# Altium project project.PrjPcb
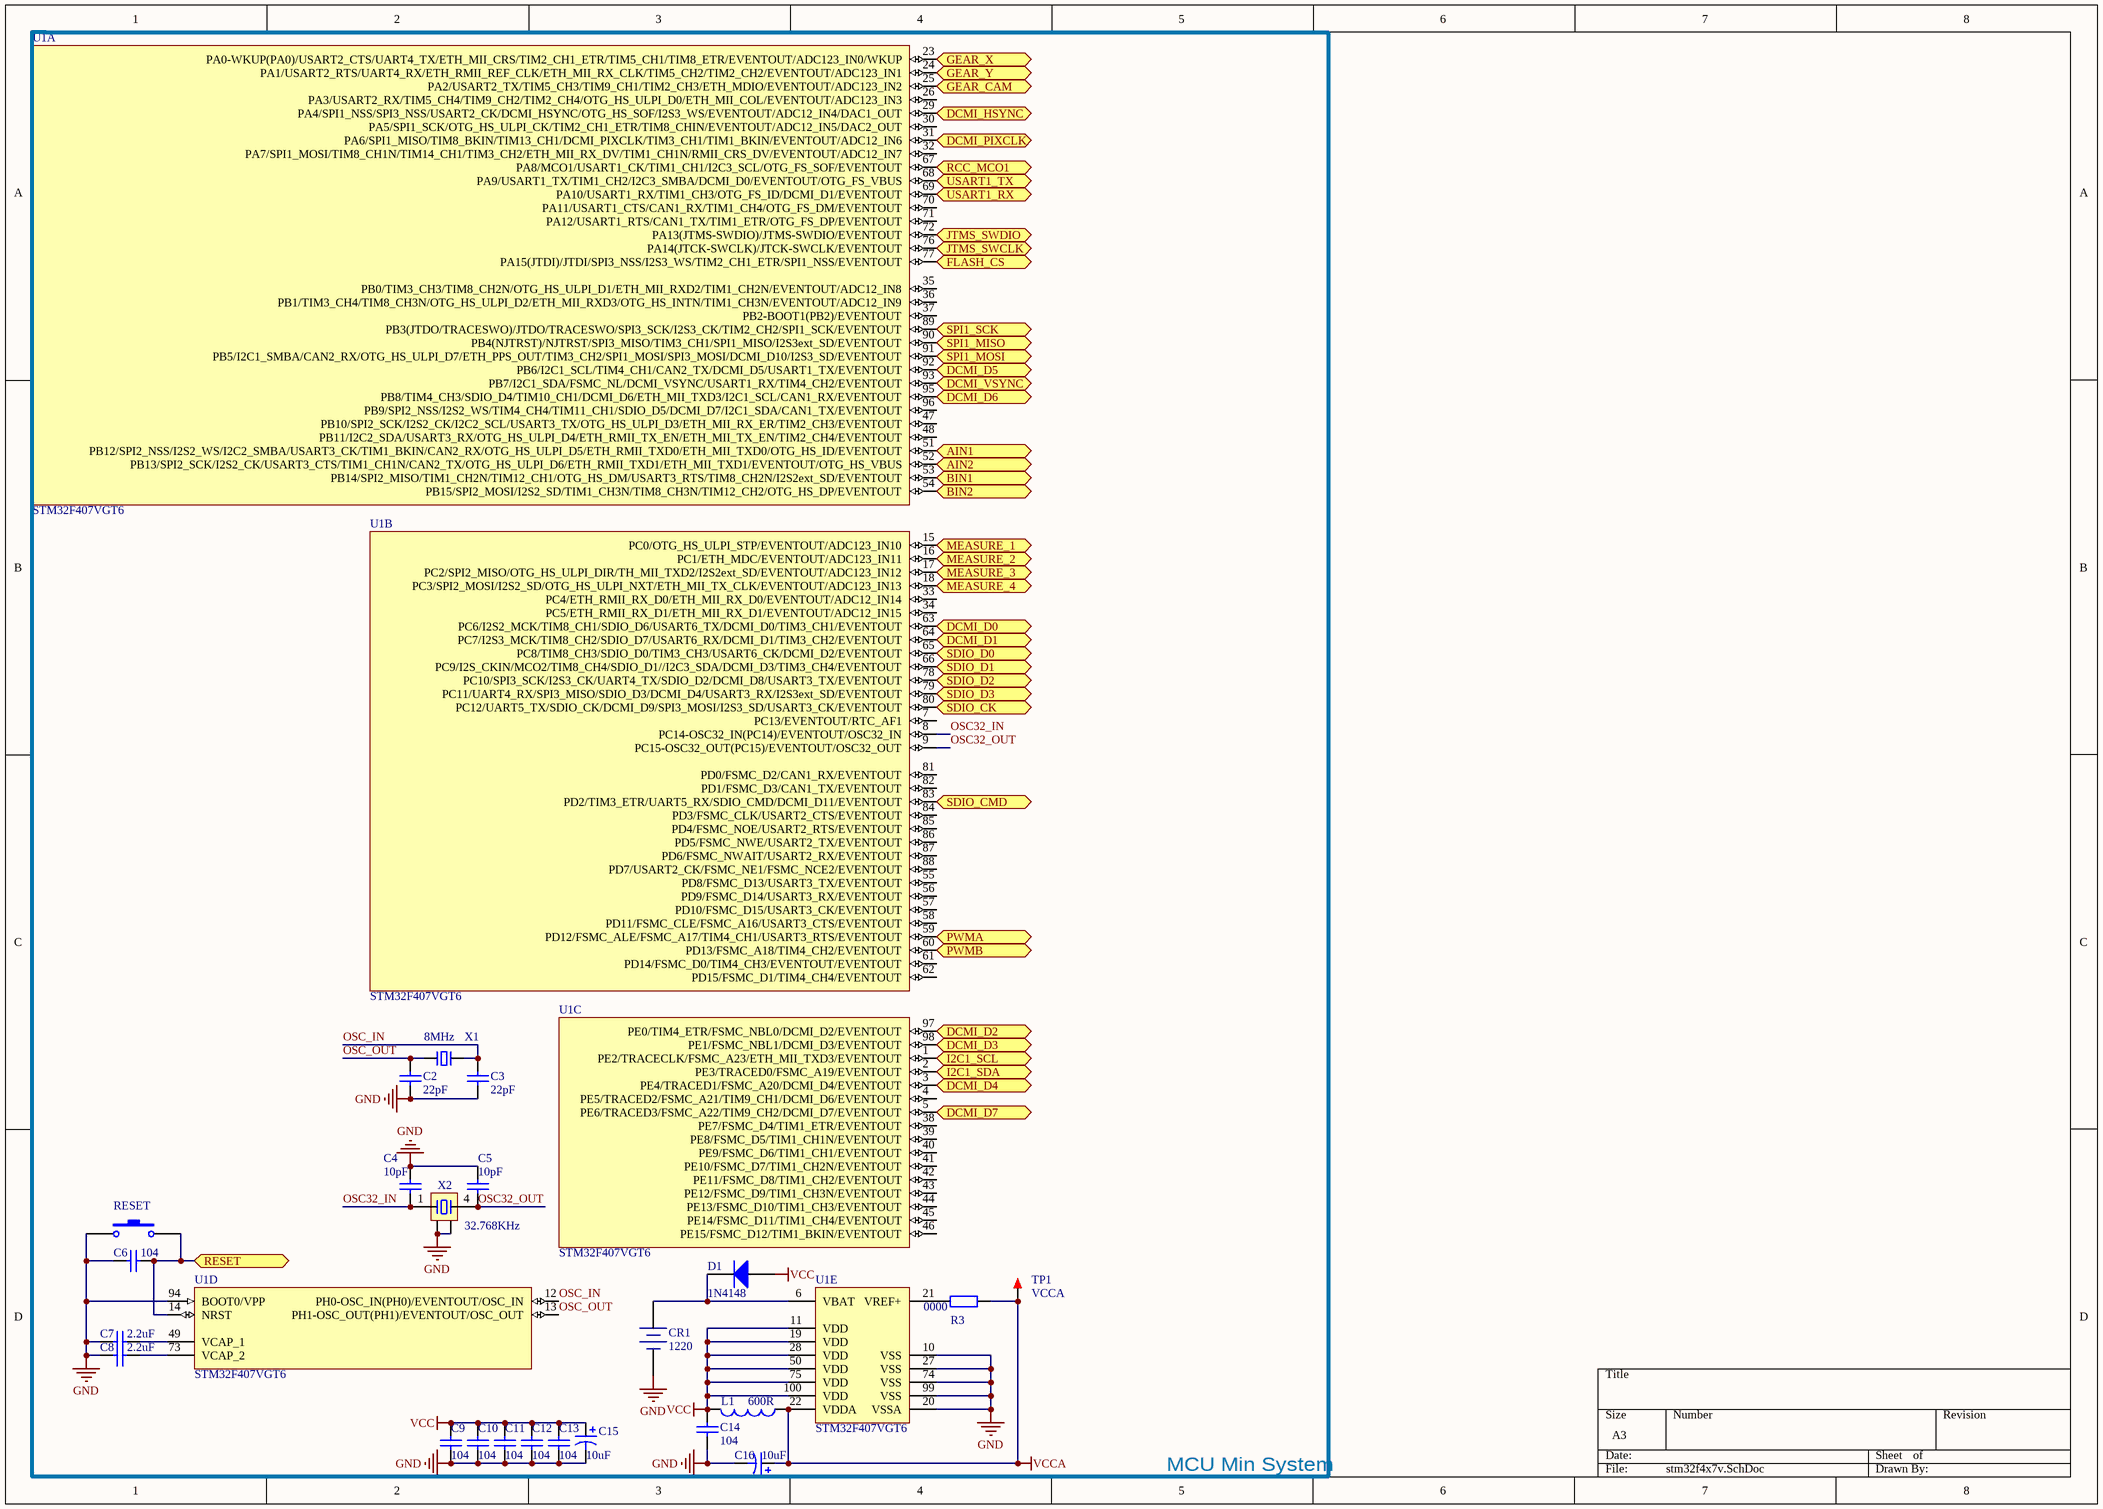
[diagram p0: stm32f4x7v.SchDoc]
4 sheets, 43 parts. Net scope: flat (ports and power ports of the same name join across sheets).
Board file: main_control_board_1.1.0.PcbDoc
Sheets:
  stm32f4x7v.SchDoc
  wifi.SchDoc
  buck.SchDoc
  steering_engine_interface.SchDoc

## Sheet stm32f4x7v.SchDoc
size A3

### Parts
C2  22pF  [C 0603_L]
C3  22pF  [C 0603_L]
C4  10pF  [C 0603_L]
C5  10pF  [C 0603_L]
C6  104  [C 0603_L]
C7  2.2uF  [C 0603_L]
C8  2.2uF  [C 0603_L]
C9  104  [C 0603_L]
C10  104  [C 0603_L]
C11  104  [C 0603_L]
C12  104  [C 0603_L]
C13  104  [C 0603_L]
C14  104  [C 0603_L]
C15  10uF  [CD A(3216)]
C16  10uF  [CD A(3216)]
CR1  1220  [ML621FE]
D1  1N4148  [SOD-523]
L1  600R  [R 0603_L]
R3  0000  [R 0603_L]
RESET  RESET  [micro button_2_SMD]  (value not drawn)
TP1  VCCA  [TEST 0.8]
U1  STM32F407VGT6  [LQFP100 14x14_N]  (parts A,B,C,D,E of 5)
X1  8MHz  [OSC 5032-2P]
X2  32.768KHz  [OSC MC-146]

### Blocks framed on the sheet
MCU Min System: C2-C16 CR1 D1 L1 R3 RESET TP1 U1 X1 X2

### Ports
AIN1 (bidir), AIN2 (bidir), BIN1 (bidir), BIN2 (bidir), DCMI_D0 (bidir), DCMI_D1 (bidir), DCMI_D2 (bidir), DCMI_D3 (bidir), DCMI_D4 (bidir), DCMI_D5 (bidir), DCMI_D6 (bidir), DCMI_D7 (bidir), DCMI_HSYNC (bidir), DCMI_PIXCLK (bidir), DCMI_VSYNC (bidir), FLASH_CS (bidir), GEAR_CAM (bidir), GEAR_X (bidir), GEAR_Y (bidir), I2C1_SCL (bidir), I2C1_SDA (bidir), JTMS_SWCLK (bidir), JTMS_SWDIO (bidir), MEASURE_1 (bidir), MEASURE_2 (bidir), MEASURE_3 (bidir), MEASURE_4 (bidir), PWMA (bidir), PWMB (bidir), RCC_MCO1 (bidir), RESET (bidir), SDIO_CK (bidir), SDIO_CMD (bidir), SDIO_D0 (bidir), SDIO_D1 (bidir), SDIO_D2 (bidir), SDIO_D3 (bidir), SPI1_MISO (bidir), SPI1_MOSI (bidir), SPI1_SCK (bidir), USART1_RX (bidir), USART1_TX (bidir)

### Nets
GND: C2.1 C3.1 C4.2 C5.2 C6.1 C7.1 C8.1 C9.1 C10.1 C11.1 C12.1 C13.1 C14.1 C15.2 C16.2 CR1.2(DC-) RESET.1 U1.10(VSS) U1.20(VSSA) U1.27(VSS) U1.74(VSS) U1.94(BOOT0/VPP) U1.99(VSS) X2.2 X2.3
VCC: C9.2 C10.2 C11.2 C12.2 C13.2 C14.2 C15.1 D1.1(A) L1.2 U1.11(VDD) U1.19(VDD) U1.28(VDD) U1.50(VDD) U1.75(VDD) U1.100(VDD)
VCCA: C16.1 L1.1 R3.1 TP1.1 U1.22(VDDA)
OSC32_IN: C4.1 U1.8(PC14-OSC32_IN(PC14)/EVENTOUT/OSC32_IN) X2.1
OSC32_OUT: C5.1 U1.9(PC15-OSC32_OUT(PC15)/EVENTOUT/OSC32_OUT) X2.4
OSC_IN: C3.2 U1.12(PH0-OSC_IN(PH0)/EVENTOUT/OSC_IN) X1.2
OSC_OUT: C2.2 U1.13(PH1-OSC_OUT(PH1)/EVENTOUT/OSC_OUT) X1.1
SDIO_CK: U1.80(PC12/UART5_TX/SDIO_CK/DCMI_D9/SPI3_MOSI/I2S3_SD/USART3_CK/EVENTOUT) ; port SDIO_CK
SDIO_CMD: U1.83(PD2/TIM3_ETR/UART5_RX/SDIO_CMD/DCMI_D11/EVENTOUT) ; port SDIO_CMD
SDIO_D0: U1.65(PC8/TIM8_CH3/SDIO_D0/TIM3_CH3/USART6_CK/DCMI_D2/EVENTOUT) ; port SDIO_D0
SDIO_D1: U1.66(PC9/I2S_CKIN/MCO2/TIM8_CH4/SDIO_D1//I2C3_SDA/DCMI_D3/TIM3_CH4/EVENTOUT) ; port SDIO_D1
SDIO_D2: U1.78(PC10/SPI3_SCK/I2S3_CK/UART4_TX/SDIO_D2/DCMI_D8/USART3_TX/EVENTOUT) ; port SDIO_D2
SDIO_D3: U1.79(PC11/UART4_RX/SPI3_MISO/SDIO_D3/DCMI_D4/USART3_RX/I2S3ext_SD/EVENTOUT) ; port SDIO_D3
NetC6_2: C6.2 RESET.2 U1.14(NRST) ; port RESET
NetC7_2: C7.2 U1.49(VCAP_1)
NetC8_2: C8.2 U1.73(VCAP_2)
NetCR1_1: CR1.1(DC+) D1.2(K) U1.6(VBAT)
NetJP8_2: U1.23(PA0-WKUP(PA0)/USART2_CTS/UART4_TX/ETH_MII_CRS/TIM2_CH1_ETR/TIM5_CH1/TIM8_ETR/EVENTOUT/ADC123_IN0/WKUP) ; port GEAR_X
NetJP9_2: U1.24(PA1/USART2_RTS/UART4_RX/ETH_RMII_REF_CLK/ETH_MII_RX_CLK/TIM5_CH2/TIM2_CH2/EVENTOUT/ADC123_IN1) ; port GEAR_Y
NetJP10_2: U1.25(PA2/USART2_TX/TIM5_CH3/TIM9_CH1/TIM2_CH3/ETH_MDIO/EVENTOUT/ADC123_IN2) ; port GEAR_CAM
NetR3_2: R3.2 U1.21(VREF+)
NetU1_1: U1.1(PE2/TRACECLK/FSMC_A23/ETH_MII_TXD3/EVENTOUT) ; port I2C1_SCL
NetU1_2: U1.2(PE3/TRACED0/FSMC_A19/EVENTOUT) ; port I2C1_SDA
NetU1_3: U1.3(PE4/TRACED1/FSMC_A20/DCMI_D4/EVENTOUT) ; port DCMI_D4
NetU1_5: U1.5(PE6/TRACED3/FSMC_A22/TIM9_CH2/DCMI_D7/EVENTOUT) ; port DCMI_D7
NetU1_15: U1.15(PC0/OTG_HS_ULPI_STP/EVENTOUT/ADC123_IN10) ; port MEASURE_1
NetU1_16: U1.16(PC1/ETH_MDC/EVENTOUT/ADC123_IN11) ; port MEASURE_2
NetU1_17: U1.17(PC2/SPI2_MISO/OTG_HS_ULPI_DIR/TH_MII_TXD2/I2S2ext_SD/EVENTOUT/ADC123_IN12) ; port MEASURE_3
NetU1_18: U1.18(PC3/SPI2_MOSI/I2S2_SD/OTG_HS_ULPI_NXT/ETH_MII_TX_CLK/EVENTOUT/ADC123_IN13) ; port MEASURE_4
NetU1_29: U1.29(PA4/SPI1_NSS/SPI3_NSS/USART2_CK/DCMI_HSYNC/OTG_HS_SOF/I2S3_WS/EVENTOUT/ADC12_IN4/DAC1_OUT) ; port DCMI_HSYNC
NetU1_31: U1.31(PA6/SPI1_MISO/TIM8_BKIN/TIM13_CH1/DCMI_PIXCLK/TIM3_CH1/TIM1_BKIN/EVENTOUT/ADC12_IN6) ; port DCMI_PIXCLK
NetU1_51: U1.51(PB12/SPI2_NSS/I2S2_WS/I2C2_SMBA/USART3_CK/TIM1_BKIN/CAN2_RX/OTG_HS_ULPI_D5/ETH_RMII_TXD0/ETH_MII_TXD0/OTG_HS_ID/EVENTOUT) ; port AIN1
NetU1_52: U1.52(PB13/SPI2_SCK/I2S2_CK/USART3_CTS/TIM1_CH1N/CAN2_TX/OTG_HS_ULPI_D6/ETH_RMII_TXD1/ETH_MII_TXD1/EVENTOUT/OTG_HS_VBUS) ; port AIN2
NetU1_53: U1.53(PB14/SPI2_MISO/TIM1_CH2N/TIM12_CH1/OTG_HS_DM/USART3_RTS/TIM8_CH2N/I2S2ext_SD/EVENTOUT) ; port BIN1
NetU1_54: U1.54(PB15/SPI2_MOSI/I2S2_SD/TIM1_CH3N/TIM8_CH3N/TIM12_CH2/OTG_HS_DP/EVENTOUT) ; port BIN2
NetU1_59: U1.59(PD12/FSMC_ALE/FSMC_A17/TIM4_CH1/USART3_RTS/EVENTOUT) ; port PWMA
NetU1_60: U1.60(PD13/FSMC_A18/TIM4_CH2/EVENTOUT) ; port PWMB
NetU1_63: U1.63(PC6/I2S2_MCK/TIM8_CH1/SDIO_D6/USART6_TX/DCMI_D0/TIM3_CH1/EVENTOUT) ; port DCMI_D0
NetU1_64: U1.64(PC7/I2S3_MCK/TIM8_CH2/SDIO_D7/USART6_RX/DCMI_D1/TIM3_CH2/EVENTOUT) ; port DCMI_D1
NetU1_67: U1.67(PA8/MCO1/USART1_CK/TIM1_CH1/I2C3_SCL/OTG_FS_SOF/EVENTOUT) ; port RCC_MCO1
NetU1_68: U1.68(PA9/USART1_TX/TIM1_CH2/I2C3_SMBA/DCMI_D0/EVENTOUT/OTG_FS_VBUS) ; port USART1_TX
NetU1_69: U1.69(PA10/USART1_RX/TIM1_CH3/OTG_FS_ID/DCMI_D1/EVENTOUT) ; port USART1_RX
NetU1_72: U1.72(PA13(JTMS-SWDIO)/JTMS-SWDIO/EVENTOUT) ; port JTMS_SWDIO
NetU1_76: U1.76(PA14(JTCK-SWCLK)/JTCK-SWCLK/EVENTOUT) ; port JTMS_SWCLK
NetU1_77: U1.77(PA15(JTDI)/JTDI/SPI3_NSS/I2S3_WS/TIM2_CH1_ETR/SPI1_NSS/EVENTOUT) ; port FLASH_CS
NetU1_89: U1.89(PB3(JTDO/TRACESWO)/JTDO/TRACESWO/SPI3_SCK/I2S3_CK/TIM2_CH2/SPI1_SCK/EVENTOUT) ; port SPI1_SCK
NetU1_90: U1.90(PB4(NJTRST)/NJTRST/SPI3_MISO/TIM3_CH1/SPI1_MISO/I2S3ext_SD/EVENTOUT) ; port SPI1_MISO
NetU1_91: U1.91(PB5/I2C1_SMBA/CAN2_RX/OTG_HS_ULPI_D7/ETH_PPS_OUT/TIM3_CH2/SPI1_MOSI/SPI3_MOSI/DCMI_D10/I2S3_SD/EVENTOUT) ; port SPI1_MOSI
NetU1_92: U1.92(PB6/I2C1_SCL/TIM4_CH1/CAN2_TX/DCMI_D5/USART1_TX/EVENTOUT) ; port DCMI_D5
NetU1_93: U1.93(PB7/I2C1_SDA/FSMC_NL/DCMI_VSYNC/USART1_RX/TIM4_CH2/EVENTOUT) ; port DCMI_VSYNC
NetU1_95: U1.95(PB8/TIM4_CH3/SDIO_D4/TIM10_CH1/DCMI_D6/ETH_MII_TXD3/I2C1_SCL/CAN1_RX/EVENTOUT) ; port DCMI_D6
NetU1_97: U1.97(PE0/TIM4_ETR/FSMC_NBL0/DCMI_D2/EVENTOUT) ; port DCMI_D2
NetU1_98: U1.98(PE1/FSMC_NBL1/DCMI_D3/EVENTOUT) ; port DCMI_D3

Not connected (* = marked no-connect by the designer): U1 4(PE5/TRACED2/FSMC_A21/TIM9_CH1/DCMI_D6/EVENTOUT) 7(PC13/EVENTOUT/RTC_AF1) 26(PA3/USART2_RX/TIM5_CH4/TIM9_CH2/TIM2_CH4/OTG_HS_ULPI_D0/ETH_MII_COL/EVENTOUT/ADC123_IN3) 30(PA5/SPI1_SCK/OTG_HS_ULPI_CK/TIM2_CH1_ETR/TIM8_CHIN/EVENTOUT/ADC12_IN5/DAC2_OUT) 32(PA7/SPI1_MOSI/TIM8_CH1N/TIM14_CH1/TIM3_CH2/ETH_MII_RX_DV/TIM1_CH1N/RMII_CRS_DV/EVENTOUT/ADC12_IN7) 33(PC4/ETH_RMII_RX_D0/ETH_MII_RX_D0/EVENTOUT/ADC12_IN14) 34(PC5/ETH_RMII_RX_D1/ETH_MII_RX_D1/EVENTOUT/ADC12_IN15) 35(PB0/TIM3_CH3/TIM8_CH2N/OTG_HS_ULPI_D1/ETH_MII_RXD2/TIM1_CH2N/EVENTOUT/ADC12_IN8) 36(PB1/TIM3_CH4/TIM8_CH3N/OTG_HS_ULPI_D2/ETH_MII_RXD3/OTG_HS_INTN/TIM1_CH3N/EVENTOUT/ADC12_IN9) 37(PB2-BOOT1(PB2)/EVENTOUT) 38(PE7/FSMC_D4/TIM1_ETR/EVENTOUT) 39(PE8/FSMC_D5/TIM1_CH1N/EVENTOUT) 40(PE9/FSMC_D6/TIM1_CH1/EVENTOUT) 41(PE10/FSMC_D7/TIM1_CH2N/EVENTOUT) 42(PE11/FSMC_D8/TIM1_CH2/EVENTOUT) 43(PE12/FSMC_D9/TIM1_CH3N/EVENTOUT) 44(PE13/FSMC_D10/TIM1_CH3/EVENTOUT) 45(PE14/FSMC_D11/TIM1_CH4/EVENTOUT) 46(PE15/FSMC_D12/TIM1_BKIN/EVENTOUT) 47(PB10/SPI2_SCK/I2S2_CK/I2C2_SCL/USART3_TX/OTG_HS_ULPI_D3/ETH_MII_RX_ER/TIM2_CH3/EVENTOUT) 48(PB11/I2C2_SDA/USART3_RX/OTG_HS_ULPI_D4/ETH_RMII_TX_EN/ETH_MII_TX_EN/TIM2_CH4/EVENTOUT) 55(PD8/FSMC_D13/USART3_TX/EVENTOUT) 56(PD9/FSMC_D14/USART3_RX/EVENTOUT) 57(PD10/FSMC_D15/USART3_CK/EVENTOUT) 58(PD11/FSMC_CLE/FSMC_A16/USART3_CTS/EVENTOUT) 61(PD14/FSMC_D0/TIM4_CH3/EVENTOUT/EVENTOUT) 62(PD15/FSMC_D1/TIM4_CH4/EVENTOUT) 70(PA11/USART1_CTS/CAN1_RX/TIM1_CH4/OTG_FS_DM/EVENTOUT) 71(PA12/USART1_RTS/CAN1_TX/TIM1_ETR/OTG_FS_DP/EVENTOUT) 81(PD0/FSMC_D2/CAN1_RX/EVENTOUT) 82(PD1/FSMC_D3/CAN1_TX/EVENTOUT) 84(PD3/FSMC_CLK/USART2_CTS/EVENTOUT) 85(PD4/FSMC_NOE/USART2_RTS/EVENTOUT) 86(PD5/FSMC_NWE/USART2_TX/EVENTOUT) 87(PD6/FSMC_NWAIT/USART2_RX/EVENTOUT) 88(PD7/USART2_CK/FSMC_NE1/FSMC_NCE2/EVENTOUT) 96(PB9/SPI2_NSS/I2S2_WS/TIM4_CH4/TIM11_CH1/SDIO_D5/DCMI_D7/I2C1_SDA/CAN1_TX/EVENTOUT)

### Library data of the parts
C2-C14 = Cap: Capacitor; Published: 8-Jun-2000; LatestRevisionDate: 17-Jul-2002; LatestRevisionNote: Re-released for DXP Platform.; PackageReference: RAD-0.3; Publisher: Altium Limited; PackageDescription: Radial Cap, Thru-Hole; 2 Leads; 0.3 in Pin Spacing
  C2 C3: Value: 22pF
  C4 C5: Value: 10pF
  C6 C9-C14: Value: 104
  C7 C8: Value: 2.2uF
C15 C16 = Cap Pol1: Polarized Capacitor (Radial); Published: 8-Jun-2000; LatestRevisionDate: 17-Jul-2002; LatestRevisionNote: Re-released for DXP Platform.; PackageReference: RB7.6-15; Publisher: Altium Limited; PackageDescription: Polarized Capacitor (Radial); 2 Leads; Value: 10uF
CR1 = CR-3V: 微型电池; 版权归属: 源创客; BOM名称: 微型电池; 学习资源: www.ooocke.com
D1 = Diode 1N4148: High Conductance Fast Diode; Published: 8-Jun-2000; LatestRevisionDate: 17-Jul-2002; LatestRevisionNote: Re-released for DXP Platform.; DatasheetVersion: 1997; PackageReference: DO-35; Publisher: Altium Limited; PackageDescription: Diode, Axial; Body 3.8 x 1.9 mm (LxDia. max), Lead Dia. 0.53 mm (max); Code_JEDEC: DO-204-AH; ComponentLink1Description: Manufacturer Link; ComponentLink1URL: http://www.fairchildsemi.com/; ComponentLink2Description: Datasheet; ComponentLink2URL: http://www.fairchildsemi.com/ds/1N%2F1N4148.pdf
L1 = Inductor: Code_IEC: 1005; Published: 8-Jun-2000; LatestRevisionDate: 29-May-2009; LatestRevisionNote: IPC-7351 Footprint Added.; PackageReference: 0402-A; Publisher: Altium Limited; PackageDescription: Chip Inductor; Code_JEITA: 0402; Value: 600R
R3 = Res2: Resistor; Published: 8-Jun-2000; LatestRevisionDate: 17-Jul-2002; LatestRevisionNote: Re-released for DXP Platform.; PackageReference: AXIAL-0.4; Publisher: Altium Limited; PackageDescription: Axial Device, Thru-Hole; 2 Leads; 0.4 in Pin Spacing; Value: 0000
RESET = SW-PB: Switch; Published: 24-Mar-1999; LatestRevisionDate: 17-Jul-2002; LatestRevisionNote: Re-released for DXP Platform.; PackageReference: SPST-2; Publisher: Altium Limited; PackageDescription: Switch; 2 Leads
TP1 = TEST: 测试点; 版权归属: 源创客; BOM名称: 测试点; 学习资源: www.ooocke.com
U1 = STM32F407VGT6: ARM Cortex-M4 32b MCU+FPU, 210DMIP, 1024 kB Flash, 192+4 kB RAM, Camera, 82 I/Os, 100-pin LQFP, -40 to +85癈, Tray; Internal RAM: 192kB; Operating Frequency (Processor Speed): 168MHz; A/D Converter: 16x12-bit; D/A Converter: 2x12-bit; 16-bit Timers (IC/OC/PWM): 12x16-bit(24/24/30); 32-bit Timer (IC/OC/PWM): 2x32-bit (8/8/8); Other Timer Functions: 2xWDG, RTC, 24-bit down counter; Serial Interface: 3xSPI/2xI2S/2xI2C/3xUSART(IrDa, ISO7816)/3xUART/2xUSB OTG FS/HS, 2xCAN/Ethernet MAC10/100, SDIO; DatasheetVersion: rev2, Jan-2012; PackageVersion: 2012; PackageReference: LQFP100; PackageDescription: 100-Pin Low Profile Quad Flat Package, 14x14 mm Body, 0.5 mm Pitch; ComponentLink1Description: Manufacturer URL; ComponentLink1URL: http://www.st.com/; ComponentLink2Description: STM32F405/7 Datasheet; ComponentLink2URL: http://www.st.com/internet/com/TECHNICAL_RESOURCES/TECHNICAL_LITERATURE/DATASHEET/DM00037051.pdf; ComponentLink3Description: STM32F4 Web Page; ComponentLink3URL: http://www.st.com/internet/mcu/subclass/1521.jsp
X1 = XTAL-2P: 2脚无源脚晶振; 版权归属: 源创客; BOM名称: 2脚无源脚晶振; 学习资源: www.ooocke.com
X2 = XTAL-MC-4P: MC系列4脚晶振; BOM名称: 2脚无源脚晶振; 版权归属: 源创客; 学习资源: www.ooocke.com

## Sheet wifi.SchDoc
size A4
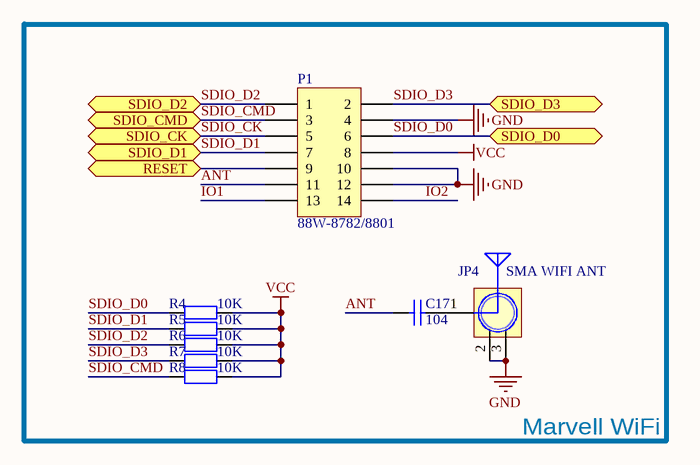
[diagram p1: wifi.SchDoc]

### Parts
C17  104  [C 0603_L]
JP4  SMA WIFI ANT  [SMA_FR]
P1  88W-8782/8801  [W8782_MODULE]
R4  10K  [R 0603_L]
R5  10K  [R 0603_L]
R6  10K  [R 0603_L]
R7  10K  [R 0603_L]
R8  10K  [R 0603_L]

### Blocks framed on the sheet
Marvell WiFi: C17 JP4 P1 R4-R8

### Ports
RESET (bidir), SDIO_CK (bidir), SDIO_CMD (bidir), SDIO_D0 (bidir), SDIO_D1 (bidir), SDIO_D2 (bidir), SDIO_D3 (bidir)

### Nets
GND: JP4.2(GND) JP4.3(GND) P1.4 P1.10 P1.12
VCC: P1.8 R4.1 R5.2 R6.2 R7.2 R8.2
ANT: C17.2 P1.11
IO1: P1.13
IO2: P1.14
SDIO_CK: P1.5 ; port SDIO_CK
SDIO_CMD: P1.3 R8.1 ; port SDIO_CMD
SDIO_D0: P1.6 R4.2 ; port SDIO_D0
SDIO_D1: P1.7 R5.1 ; port SDIO_D1
SDIO_D2: P1.1 R6.1 ; port SDIO_D2
SDIO_D3: P1.2 R7.1 ; port SDIO_D3
NetC6_2: P1.9 ; port RESET
NetC17_1: C17.1 JP4.1(ANT)

### Library data of the parts
C17 = Cap: Capacitor; Published: 8-Jun-2000; LatestRevisionDate: 17-Jul-2002; LatestRevisionNote: Re-released for DXP Platform.; PackageReference: RAD-0.3; Publisher: Altium Limited; PackageDescription: Radial Cap, Thru-Hole; 2 Leads; 0.3 in Pin Spacing; Value: 104
JP4 = SMA: SMA-2.4G射频天线接口; 版权归属: 源创客; BOM名称: SMA-2.4G射频天线接口; 学习资源: www.ooocke.com
P1 = Header 7X2: Header, 7-Pin, Dual row; LatestRevisionDate: 17-Jul-2002; LatestRevisionNote: Re-released for DXP Platform.; Publisher: Altium Limited
R4-R8 = Res2: Resistor; Published: 8-Jun-2000; LatestRevisionDate: 17-Jul-2002; LatestRevisionNote: Re-released for DXP Platform.; PackageReference: AXIAL-0.4; Publisher: Altium Limited; PackageDescription: Axial Device, Thru-Hole; 2 Leads; 0.4 in Pin Spacing; Value: 10K

## Sheet buck.SchDoc
size A4
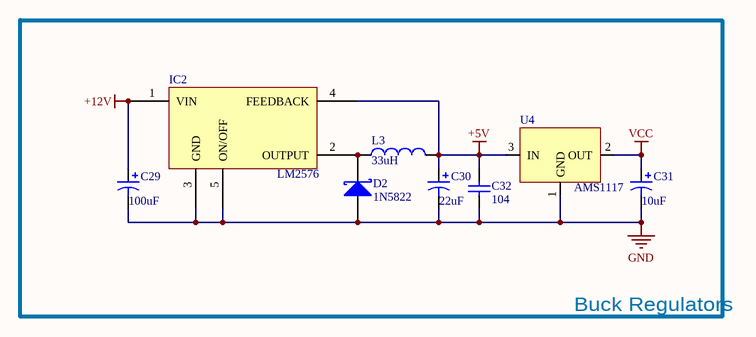
[diagram p2: buck.SchDoc]

### Parts
C29  100uF  [CM E(8*10.2)]
C30  22uF  [CD A(3216)]
C31  10uF  [CD A(3216)]
C32  104  [C 0603_L]
D2  1N5822  [SMC]
IC2  LM2576  [TO263-5A]
L3  33uH  [CDRH127]
U4  AMS1117  [SOT_223]

### Blocks framed on the sheet
Buck Regulators: C29-C32 D2 IC2 L3 U4

### Nets
+5V: C30.1 C32.2 IC2.4(FEEDBACK) L3.2 U4.3(IN)
+12V: C29.1 IC2.1(VIN)
GND: C29.2 C30.2 C31.2 C32.1 D2.1(A) IC2.3(GND) IC2.5(ON/OFF) U4.1(GND)
VCC: C31.1 U4.2(OUT)
NetD2_2: D2.2(K) IC2.2(OUTPUT) L3.1

### Library data of the parts
C29-C31 = Cap Pol1: Polarized Capacitor (Radial); Published: 8-Jun-2000; LatestRevisionDate: 17-Jul-2002; LatestRevisionNote: Re-released for DXP Platform.; PackageReference: RB7.6-15; Publisher: Altium Limited; PackageDescription: Polarized Capacitor (Radial); 2 Leads
  C29: Value: 100uF
  C30: Value: 22uF
  C31: Value: 10uF
C32 = Cap: Capacitor; Published: 8-Jun-2000; LatestRevisionDate: 17-Jul-2002; LatestRevisionNote: Re-released for DXP Platform.; PackageReference: RAD-0.3; Publisher: Altium Limited; PackageDescription: Radial Cap, Thru-Hole; 2 Leads; 0.3 in Pin Spacing; Value: 104
D2 = Diode 11DQ03: Schottky Rectifier; Published: 8-Jun-2000; LatestRevisionDate: 17-Jul-2002; LatestRevisionNote: Re-released for DXP Platform.; DatasheetVersion: Dec-1997; PackageReference: DO-204AL; Publisher: Altium Limited; PackageDescription: Diode, Axial; Body 5.2 x 2.7 mm (LxDia. max), Lead Dia. 0.86 mm (max); Code_JEDEC: DO-204-AL; ComponentLink1Description: Manufacturer Link; ComponentLink1URL: http://www.irf.com/; ComponentLink2Description: Datasheet; ComponentLink2URL: http://www.irf.com/product-info/datasheets/data/11dq03.pdf
IC2 = LM2576: 稳压
L3 = Inductor: Code_IEC: 1005; Published: 8-Jun-2000; LatestRevisionDate: 29-May-2009; LatestRevisionNote: IPC-7351 Footprint Added.; PackageReference: 0402-A; Publisher: Altium Limited; PackageDescription: Chip Inductor; Code_JEITA: 0402; Value: 33uH

## Sheet steering_engine_interface.SchDoc
size A4
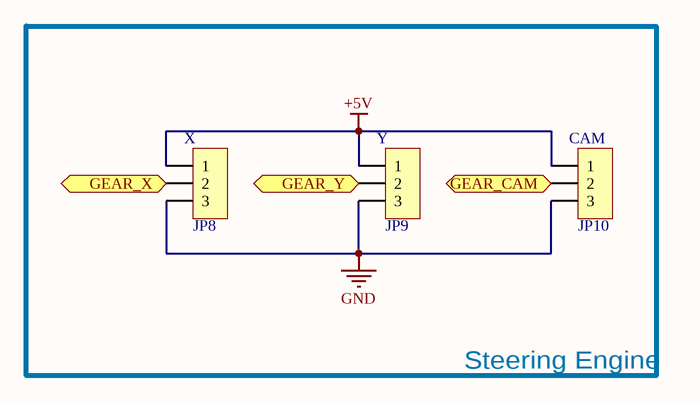
[diagram p3: steering_engine_interface.SchDoc]

### Parts
JP8  X  [HDR2.54-LI-3P]
JP9  Y  [HDR2.54-LI-3P]
JP10  CAM  [HDR2.54-LI-3P]

### Blocks framed on the sheet
Steering Engine: JP8-JP10

### Ports
GEAR_CAM (bidir), GEAR_X (bidir), GEAR_Y (bidir)

### Nets
+5V: JP8.1 JP9.1 JP10.1
GND: JP8.3 JP9.3 JP10.3
NetJP8_2: JP8.2 ; port GEAR_X
NetJP9_2: JP9.2 ; port GEAR_Y
NetJP10_2: JP10.2 ; port GEAR_CAM

### Library data of the parts
JP8-JP10 = Header 3: 3P接插件; 版权归属: 源创客; BOM名称: 3P接插件; 学习资源: www.ooocke.com

## Nets that join several sheets
+5V: buck (5 pins), steering_engine_interface (JP8.1 JP9.1 JP10.1)
GND: stm32f4x7v (25 pins), wifi (5 pins), buck (8 pins), steering_engine_interface (JP8.3 JP9.3 JP10.3)
VCC: stm32f4x7v (15 pins), wifi (6 pins), buck (C31.1 U4.2)
NetC6_2: stm32f4x7v (C6.2 RESET.2 U1.14), wifi (P1.9)
NetJP8_2: stm32f4x7v (U1.23), steering_engine_interface (JP8.2)
NetJP9_2: stm32f4x7v (U1.24), steering_engine_interface (JP9.2)
NetJP10_2: stm32f4x7v (U1.25), steering_engine_interface (JP10.2)
SDIO_CK: stm32f4x7v (U1.80), wifi (P1.5)
SDIO_CMD: stm32f4x7v (U1.83), wifi (P1.3 R8.1)
SDIO_D0: stm32f4x7v (U1.65), wifi (P1.6 R4.2)
SDIO_D1: stm32f4x7v (U1.66), wifi (P1.7 R5.1)
SDIO_D2: stm32f4x7v (U1.78), wifi (P1.1 R6.1)
SDIO_D3: stm32f4x7v (U1.79), wifi (P1.2 R7.1)